# Altium schematic sheet SCH8_BBB.SchDoc: Beaglebone Black
size B; Organization: CWRUbotix; Address1: 10900 Euclid Avenue; Address2: Cleveland, OH 44106; Address3: USA; Revision: 1.0; SheetNumber: 8; SheetTotal: 13
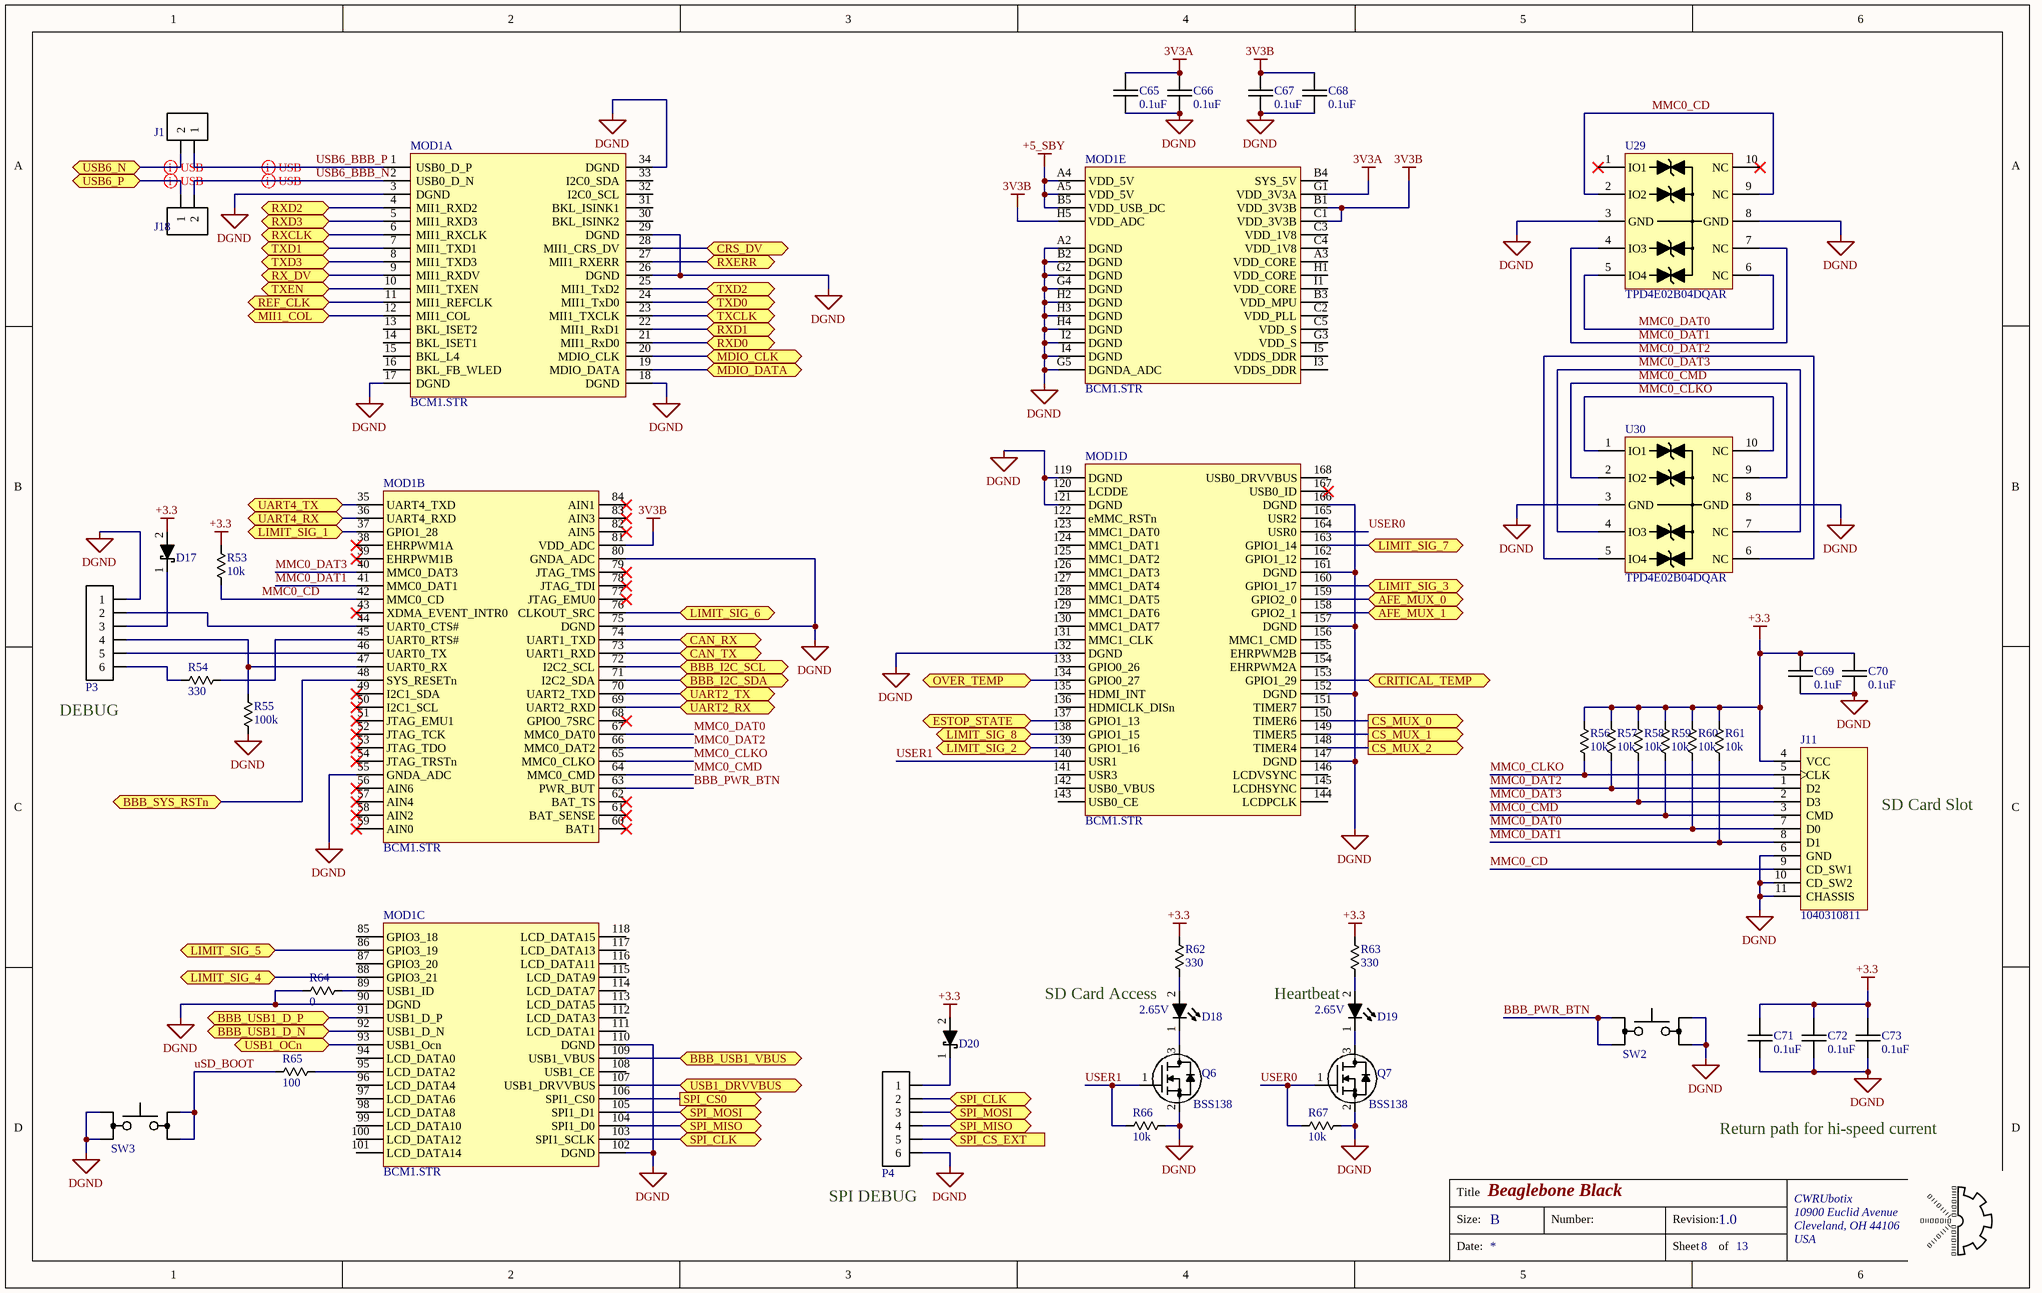
[diagram p0: SCH8_BBB.SchDoc]

## Parts
C65  0.1uF  [chip_0603]
C66  0.1uF  [chip_0603]
C67  0.1uF  [chip_0603]
C68  0.1uF  [chip_0603]
C69  0.1uF  [chip_0603]
C70  0.1uF  [chip_0603]
C71  0.1uF  [chip_0603]
C72  0.1uF  [chip_0603]
C73  0.1uF  [chip_0603]
D17  diode_2  [sod123_0]  (value not drawn)
D18  Forward Voltage: 2.65V  [chip_0603_LED]  (hidden comment: diode_4)
D19  Forward Voltage: 2.65V  [chip_0603_LED]  (hidden comment: diode_4)
D20  diode_2  [sod123_0]  (value not drawn)
J1  conn-2x1_0  [HDDR_2x1_0]  (value not drawn)
J11  1040310811  [MOLEX_1040310811]
J18  conn-2x1_0  [HDDR_2x1_0]  (value not drawn)
MOD1  BCM1.STR  [BEAGLECORE_BCM1]  (parts A,B,C,D,E of 5)
P3  conn-6x1_0  [HDDR_6X1_0]  (value not drawn)
P4  conn-6x1_0  [HDDR_6X1_0]  (value not drawn)
Q6  Manufacturer PN: BSS138  [sot-23-3]  (hidden comment: n-mosfet_1)
Q7  Manufacturer PN: BSS138  [sot-23-3]  (hidden comment: n-mosfet_1)
R53  10k  [chip_0603]
R54  330  [chip_0603]
R55  100k  [chip_0603]
R56  10k  [chip_0603]
R57  10k  [chip_0603]
R58  10k  [chip_0603]
R59  10k  [chip_0603]
R60  10k  [chip_0603]
R61  10k  [chip_0603]
R62  330  [chip_0603]
R63  330  [chip_0603]
R64  0  [chip_0805]
R65  100  [chip_0603]
R66  10k  [chip_0603]
R67  10k  [chip_0603]
SW2  SW_1P1T_2  [B3FS-1000]  (value not drawn)
SW3  SW_1P1T_2  [B3FS-1000]  (value not drawn)
U29  TPD4E02B04DQAR  [USON-10]
U30  TPD4E02B04DQAR  [USON-10]

## Ports
AFE_MUX_0 (bidir), AFE_MUX_1 (bidir), BBB_I2C_SCL (bidir), BBB_I2C_SDA (bidir), BBB_SYS_RSTn (bidir), BBB_USB1_D_N (bidir), BBB_USB1_D_P (bidir), BBB_USB1_VBUS (bidir), CAN_RX (bidir), CAN_TX (bidir), CRITICAL_TEMP (bidir), CRS_DV (bidir), CS_MUX_0 (out), CS_MUX_1 (out), CS_MUX_2 (out), ESTOP_STATE (bidir), LIMIT_SIG_1 (bidir), LIMIT_SIG_2 (bidir), LIMIT_SIG_3 (bidir), LIMIT_SIG_4 (bidir), LIMIT_SIG_5 (bidir), LIMIT_SIG_6 (bidir), LIMIT_SIG_7 (bidir), LIMIT_SIG_8 (bidir), MDIO_CLK (bidir), MDIO_DATA (bidir), MII1_COL (bidir), OVER_TEMP (bidir), REF_CLK (bidir), RX_DV (bidir), RXCLK (bidir), RXD0 (bidir), RXD1 (bidir), RXD2 (bidir), RXD3 (bidir), RXERR (bidir), SPI_CLK (bidir), SPI_CS0 (out), SPI_CS_EXT (in), SPI_MISO (bidir), SPI_MOSI (bidir), TXCLK (bidir), TXD0 (bidir), TXD1 (bidir), TXD2 (bidir), TXD3 (bidir), TXEN (bidir), UART2_RX (bidir), UART2_TX (bidir), UART4_RX (bidir), UART4_TX (bidir), USB1_DRVVBUS (bidir), USB1_OCn (bidir), USB6_N (bidir), USB6_P (bidir)

## Nets
3V3A: C65.2 C66.2 MOD1.G1(VDD_3V3A)
3V3B: C67.2 C68.2 MOD1.81(VDD_ADC) MOD1.B1(VDD_3V3B) MOD1.C1(VDD_3V3B) MOD1.H5(VDD_ADC)
+3.3: C69.2 C70.2 C71.2 C72.2 C73.2 D17.2 D20.2 J11.4(VCC) R53.1 R56.1 R57.1 R58.1 R59.1 R60.1 R61.1 R62.2 R63.2
+5_SBY: MOD1.A4(VDD_5V) MOD1.A5(VDD_5V) MOD1.B5(VDD_USB_DC)
DGND: C65.1 C66.1 C67.1 C68.1 C69.1 C70.1 C71.1 C72.1 C73.1 J11.6(GND) J11.10(CD_SW2) J11.11(CHASSIS) MOD1.3(DGND) MOD1.17(DGND) MOD1.18(DGND) MOD1.26(DGND) MOD1.29(DGND) MOD1.34(DGND) MOD1.55(GNDA_ADC) MOD1.75(DGND) MOD1.80(GNDA_ADC) MOD1.90(DGND) MOD1.102(DGND) MOD1.110(DGND) MOD1.119(DGND) MOD1.121(DGND) MOD1.132(DGND) MOD1.147(DGND) MOD1.152(DGND) MOD1.157(DGND) MOD1.161(DGND) MOD1.166(DGND) MOD1.A2(DGND) MOD1.B2(DGND) MOD1.G2(DGND) MOD1.G4(DGND) MOD1.G5(DGNDA_ADC) MOD1.H2(DGND) MOD1.H3(DGND) MOD1.H4(DGND) MOD1.I2(DGND) MOD1.I4(DGND) P3.1 P4.6 Q6.2(S) Q7.2(S) R55.1 R64.1 R66.2 R67.2 SW2.3 SW2.4 SW3.1 SW3.2 U29.3(GND) U29.8(GND) U30.3(GND) U30.8(GND)
AFE_MUX_0: MOD1.159(GPIO2_0) ; port AFE_MUX_0
AFE_MUX_1: MOD1.158(GPIO2_1) ; port AFE_MUX_1
BBB_I2C_SCL: MOD1.72(I2C2_SCL) ; port BBB_I2C_SCL
BBB_I2C_SDA: MOD1.71(I2C2_SDA) ; port BBB_I2C_SDA
BBB_PWR_BTN: MOD1.63(PWR_BUT) SW2.1 SW2.2
BBB_SYS_RSTn: MOD1.48(SYS_RESETn) ; port BBB_SYS_RSTn
BBB_USB1_D_N: MOD1.92(USB1_D_N) ; port BBB_USB1_D_N
BBB_USB1_D_P: MOD1.91(USB1_D_P) ; port BBB_USB1_D_P
BBB_USB1_VBUS: MOD1.109(USB1_VBUS) ; port BBB_USB1_VBUS
CAN_RX: MOD1.74(UART1_TXD) ; port CAN_RX
CAN_TX: MOD1.73(UART1_RXD) ; port CAN_TX
CRITICAL_TEMP: MOD1.153(GPIO1_29) ; port CRITICAL_TEMP
CRS_DV: MOD1.28(MII1_CRS_DV) ; port CRS_DV
CS_MUX_0: MOD1.150(TIMER6) ; port CS_MUX_0
CS_MUX_1: MOD1.149(TIMER5) ; port CS_MUX_1
CS_MUX_2: MOD1.148(TIMER4) ; port CS_MUX_2
ESTOP_STATE: MOD1.137(GPIO1_13) ; port ESTOP_STATE
LIMIT_SIG_1: MOD1.37(GPIO1_28) ; port LIMIT_SIG_1
LIMIT_SIG_2: MOD1.139(GPIO1_16) ; port LIMIT_SIG_2
LIMIT_SIG_3: MOD1.160(GPIO1_17) ; port LIMIT_SIG_3
LIMIT_SIG_4: MOD1.88(GPIO3_21) ; port LIMIT_SIG_4
LIMIT_SIG_5: MOD1.86(GPIO3_19) ; port LIMIT_SIG_5
LIMIT_SIG_6: MOD1.76(CLKOUT_SRC) ; port LIMIT_SIG_6
LIMIT_SIG_7: MOD1.163(GPIO1_14) ; port LIMIT_SIG_7
LIMIT_SIG_8: MOD1.138(GPIO1_15) ; port LIMIT_SIG_8
MDIO_CLK: MOD1.20(MDIO_CLK) ; port MDIO_CLK
MDIO_DATA: MOD1.19(MDIO_DATA) ; port MDIO_DATA
MII1_COL: MOD1.12(MII1_COL) ; port MII1_COL
MMC0_CD: J11.9(CD_SW1) MOD1.42(MMC0_CD) R53.2 U29.2(IO2) U29.9(NC)
MMC0_CLKO: J11.5(CLK) MOD1.65(MMC0_CLKO) R56.2 U30.1(IO1) U30.10(NC)
MMC0_CMD: J11.3(CMD) MOD1.64(MMC0_CMD) R59.2 U30.2(IO2) U30.9(NC)
MMC0_DAT0: J11.7(D0) MOD1.67(MMC0_DAT0) R60.2 U29.5(IO4) U29.6(NC)
MMC0_DAT1: J11.8(D1) MOD1.41(MMC0_DAT1) R61.2 U29.4(IO3) U29.7(NC)
MMC0_DAT2: J11.1(D2) MOD1.66(MMC0_DAT2) R57.2 U30.5(IO4) U30.6(NC)
MMC0_DAT3: J11.2(D3) MOD1.40(MMC0_DAT3) R58.2 U30.4(IO3) U30.7(NC)
OVER_TEMP: MOD1.134(GPIO0_27) ; port OVER_TEMP
REF_CLK: MOD1.11(MII1_REFCLK) ; port REF_CLK
RX_DV: MOD1.9(MII1_RXDV) ; port RX_DV
RXCLK: MOD1.6(MII1_RXCLK) ; port RXCLK
RXD0: MOD1.21(MII1_RxD0) ; port RXD0
RXD1: MOD1.22(MII1_RxD1) ; port RXD1
RXD2: MOD1.4(MII1_RXD2) ; port RXD2
RXD3: MOD1.5(MII1_RXD3) ; port RXD3
RXERR: MOD1.27(MII1_RXERR) ; port RXERR
SPI_CLK: MOD1.103(SPI1_SCLK) P4.2 ; port SPI_CLK
SPI_CS0: MOD1.106(SPI1_CS0) ; port SPI_CS0
SPI_CS_EXT: P4.5 ; port SPI_CS_EXT
SPI_MISO: MOD1.104(SPI1_D0) P4.4 ; port SPI_MISO
SPI_MOSI: MOD1.105(SPI1_D1) P4.3 ; port SPI_MOSI
TXCLK: MOD1.23(MII1_TXCLK) ; port TXCLK
TXD0: MOD1.24(MII1_TxD0) ; port TXD0
TXD1: MOD1.7(MII1_TXD1) ; port TXD1
TXD2: MOD1.25(MII1_TxD2) ; port TXD2
TXD3: MOD1.8(MII1_TXD3) ; port TXD3
TXEN: MOD1.10(MII1_TXEN) ; port TXEN
UART2_RX: MOD1.69(UART2_RXD) ; port UART2_RX
UART2_TX: MOD1.70(UART2_TXD) ; port UART2_TX
UART4_RX: MOD1.36(UART4_RXD) ; port UART4_RX
UART4_TX: MOD1.35(UART4_TXD) ; port UART4_TX
USB1_DRVVBUS: MOD1.107(USB1_DRVVBUS) ; port USB1_DRVVBUS
USB1_OCn: MOD1.93(USB1_Ocn) ; port USB1_OCn
USB6_BBB_N: J18.2 MOD1.2(USB0_D_N)
USB6_BBB_P: J1.1 MOD1.1(USB0_D_P)
USB6_N: J1.2 ; port USB6_N
USB6_P: J18.1 ; port USB6_P
uSD_BOOT: R65.1 SW3.3 SW3.4
USER0: MOD1.164(USR0) Q7.1(G) R67.1
USER1: MOD1.140(USR1) Q6.1(G) R66.1
NetD17_1: D17.1 P3.3
NetD18_1: D18.1 Q6.3(D)
NetD18_2: D18.2 R62.1
NetD19_1: D19.1 Q7.3(D)
NetD19_2: D19.2 R63.1
NetD20_1: D20.1 P4.1
NetMOD1_44: MOD1.44(UART0_CTS#) P3.2
NetMOD1_45: MOD1.45(UART0_RTS#) R54.1
NetMOD1_46: MOD1.46(UART0_TX) P3.5
NetMOD1_47: MOD1.47(UART0_RX) P3.4 R55.2
NetMOD1_89: MOD1.89(USB1_ID) R64.2
NetMOD1_95: MOD1.95(LCD_DATA2) R65.2
NetP3_6: P3.6 R54.2

Not connected (* = marked no-connect by the designer): MOD1 13(BKL_ISET2) 14(BKL_ISET1) 15(BKL_L4) 16(BKL_FB_WLED) 30(BKL_ISINK2) 31(BKL_ISINK1) 32(I2C0_SCL) 33(I2C0_SDA) 38(EHRPWM1A)* 39(EHRPWM1B)* 43(XDMA_EVENT_INTR0)* 49(I2C1_SDA)* 50(I2C1_SCL)* 51(JTAG_EMU1)* 52(JTAG_TCK)* 53(JTAG_TDO)* 54(JTAG_TRSTn)* 56(AIN6)* 57(AIN4)* 58(AIN2)* 59(AIN0)* 60(BAT1)* 61(BAT_SENSE)* 62(BAT_TS)* 68(GPIO0_7SRC)* 77(JTAG_EMU0)* 78(JTAG_TDI)* 79(JTAG_TMS)* 82(AIN5)* 83(AIN3)* 84(AIN1)* 85(GPIO3_18) 87(GPIO3_20) 94(LCD_DATA0) 96(LCD_DATA4) 97(LCD_DATA6) 98(LCD_DATA8) 99(LCD_DATA10) 100(LCD_DATA12) 101(LCD_DATA14) 108(USB1_CE) 111(LCD_DATA1) 112(LCD_DATA3) 113(LCD_DATA5) 114(LCD_DATA7) 115(LCD_DATA9) 116(LCD_DATA11) 117(LCD_DATA13) 118(LCD_DATA15) 120(LCDDE) 122(eMMC_RSTn) 123(MMC1_DAT0) 124(MMC1_DAT1) 125(MMC1_DAT2) 126(MMC1_DAT3) 127(MMC1_DAT4) 128(MMC1_DAT5) 129(MMC1_DAT6) 130(MMC1_DAT7) 131(MMC1_CLK) 133(GPIO0_26) 135(HDMI_INT) 136(HDMICLK_DISn) 141(USR3) 142(USB0_VBUS) 143(USB0_CE) 144(LCDPCLK) 145(LCDHSYNC) 146(LCDVSYNC) 151(TIMER7) 154(EHRPWM2A) 155(EHRPWM2B) 156(MMC1_CMD) 162(GPIO1_12) 165(USR2) 167(USB0_ID)* 168(USB0_DRVVBUS) A3(VDD_CORE) B3(VDD_MPU) B4(SYS_5V) C2(VDD_PLL) C3(VDD_1V8) C4(VDD_1V8) C5(VDD_S) G3(VDD_S) H1(VDD_CORE) I1(VDD_CORE) I3(VDDS_DDR) I5(VDDS_DDR); U29 1(IO1)* 10(NC)*

## Layout directives
differential pair: USB6_BBB_N, USB6_BBB_P, USB6_N, USB6_P

## Notes on the sheet
- (near P3) DEBUG
- SD Card Slot
- SD Card Access
- (near D19) Heartbeat
- Return path for hi-speed current
- (near P4) SPI DEBUG
- Title
- Size:
- B
- Number:
- Revision:
- Date:
- Sheet
- of

## Library data of the parts
C65-C73 = CAP-00542: CAP, 0.1uF, ±10%, 16V, X7R, 0603; Manufacturer: Murata; Part Number: CAP-00542; Capacitance: 0.1uF; Tolerance: ±10%; Voltage Rating: 16V; Type: X7R
D17 D20 = DIO-00001: Dio Shtky, 1A, 0.55V, 40V, SOD-123; Manufacturer: ON Semi; Manufacturer PN: MBR140SFT1G; Forward Voltage: 550mV; Type: Schottky; Part Number: DIO-00001; Reverse Breakdown Voltage: 40V; Current Rating: 1A
D18 D19 = DIO-00049: LED, Blue, 0603, Low current, HELI2 Series; Manufacturer: Kingbright; Manufacturer PN: APT1608LVBC/D; Reverse Breakdown Voltage: 5V; Power Rating: 120mW; Current Rating: 30mA; Part Number: DIO-00049; Type: LED; Cost: 0.58
J1 J18 = CONN-00055: Header, 2x1, 0.1"; Manufacturer: Samtec; Manufacturer PN: TSW-102-07-F-S; Positions per level: 2; Levels: 1; Part Number: CONN-00055; Type: Header; Cost: 0.2
J11 = CONN-00091: Micro SD Card Slot, Push-Pull w/ Card-Detect Switch, SMD, Molex; Positions per level: 10; Levels: 1; Part Number: CONN-00091; Type: Card Socket; Manufacturer: Molex; Manufacturer PN: 1040310811; Cost: 2.02
MOD1 = UCTRL-00011: BeagleCore BCM1, System-On-Module (SOM); Part Number: UCTRL-00011; Manufacturer: BeagleCore; Manufacturer PN: BCM1.STR
P3 P4 = CONN-00008: Header 6x1, 0.1"; Positions per level: 6; Levels: 1; Part Number: CONN-00008
Q6 Q7 = XSTR-00017: XSTR NMOS, 220mA, 50V, Vgs 1.3V, SOT-23-3; Manufacturer: ON Semi; Max Power: 360mW; Type: NFET; Part Number: XSTR-00017; Max Voltage: 50V; Max Current: 220mA; Vgs/Vce: 1.3V; Cost: 0.31
R53 R56-R61 R66 R67 = RES-00306: RES SMD 10K OHM 1% 1/4W 0603; Manufacturer: Panasonic; Manufacturer PN: ERJ-PA3F1002V; Power Rating: 0.25W; Part Number: RES-00306; Resistance: 10k; Tolerance: 1%; Cost: 0.144
R54 R62 R63 = RES-00221: RES SMD 330 OHM 1% 1/4W 0603; Manufacturer: Panasonic; Manufacturer PN: ERJ-PA3F3300V; Power Rating: 0.25W; Part Number: RES-00221; Resistance: 330; Tolerance: 1%
R55 = RES-00301: RES SMD 100K OHM 1% 1/4W 0603; Manufacturer: Panasonic; Manufacturer PN: ERJ-PA3F1003V; Power Rating: 0.25W; Part Number: RES-00301; Resistance: 100k; Tolerance: 1%
R64 = RES-00720: RES SMD 0 OHM 1/8W 0805 Thick Film; Manufacturer: Stackpole; Manufacturer PN: RMCF0805ZT0R00; Tolerance: Jumper; Part Number: RES-00720; Resistance: 0; Power Rating: 1/8W; Cost: 0.1
R65 = RES-00178: RES SMD 100 OHM 1% 1/4W 0603; Manufacturer: Panasonic; Manufacturer PN: ERJ-PA3F1000V; Power Rating: 0.25W; Part Number: RES-00178; Resistance: 100; Tolerance: 1%
SW2 SW3 = MISC-00042: Switch, SPST-NO, Tactile, 6.3x6.0mm, SMD, 50mA 24VDC; Manufacturer: Omron; Manufacturer PN: B3FS-1012P; Part Number: MISC-00042; Cost: 0.71
U29 U30 = DIO-00068: TVS, 4-Ch, ESD Protec, 3.6V 8.8V 10-USON; Manufacturer: TI; Power Rating: 17W; Current Rating: 2A; Part Number: DIO-00068; Type: TVS; Manufacturer PN: TPD4E02B04DQAR; Cost: 0.56